# EAGLE design scanner (EAGLE 9.2.2)
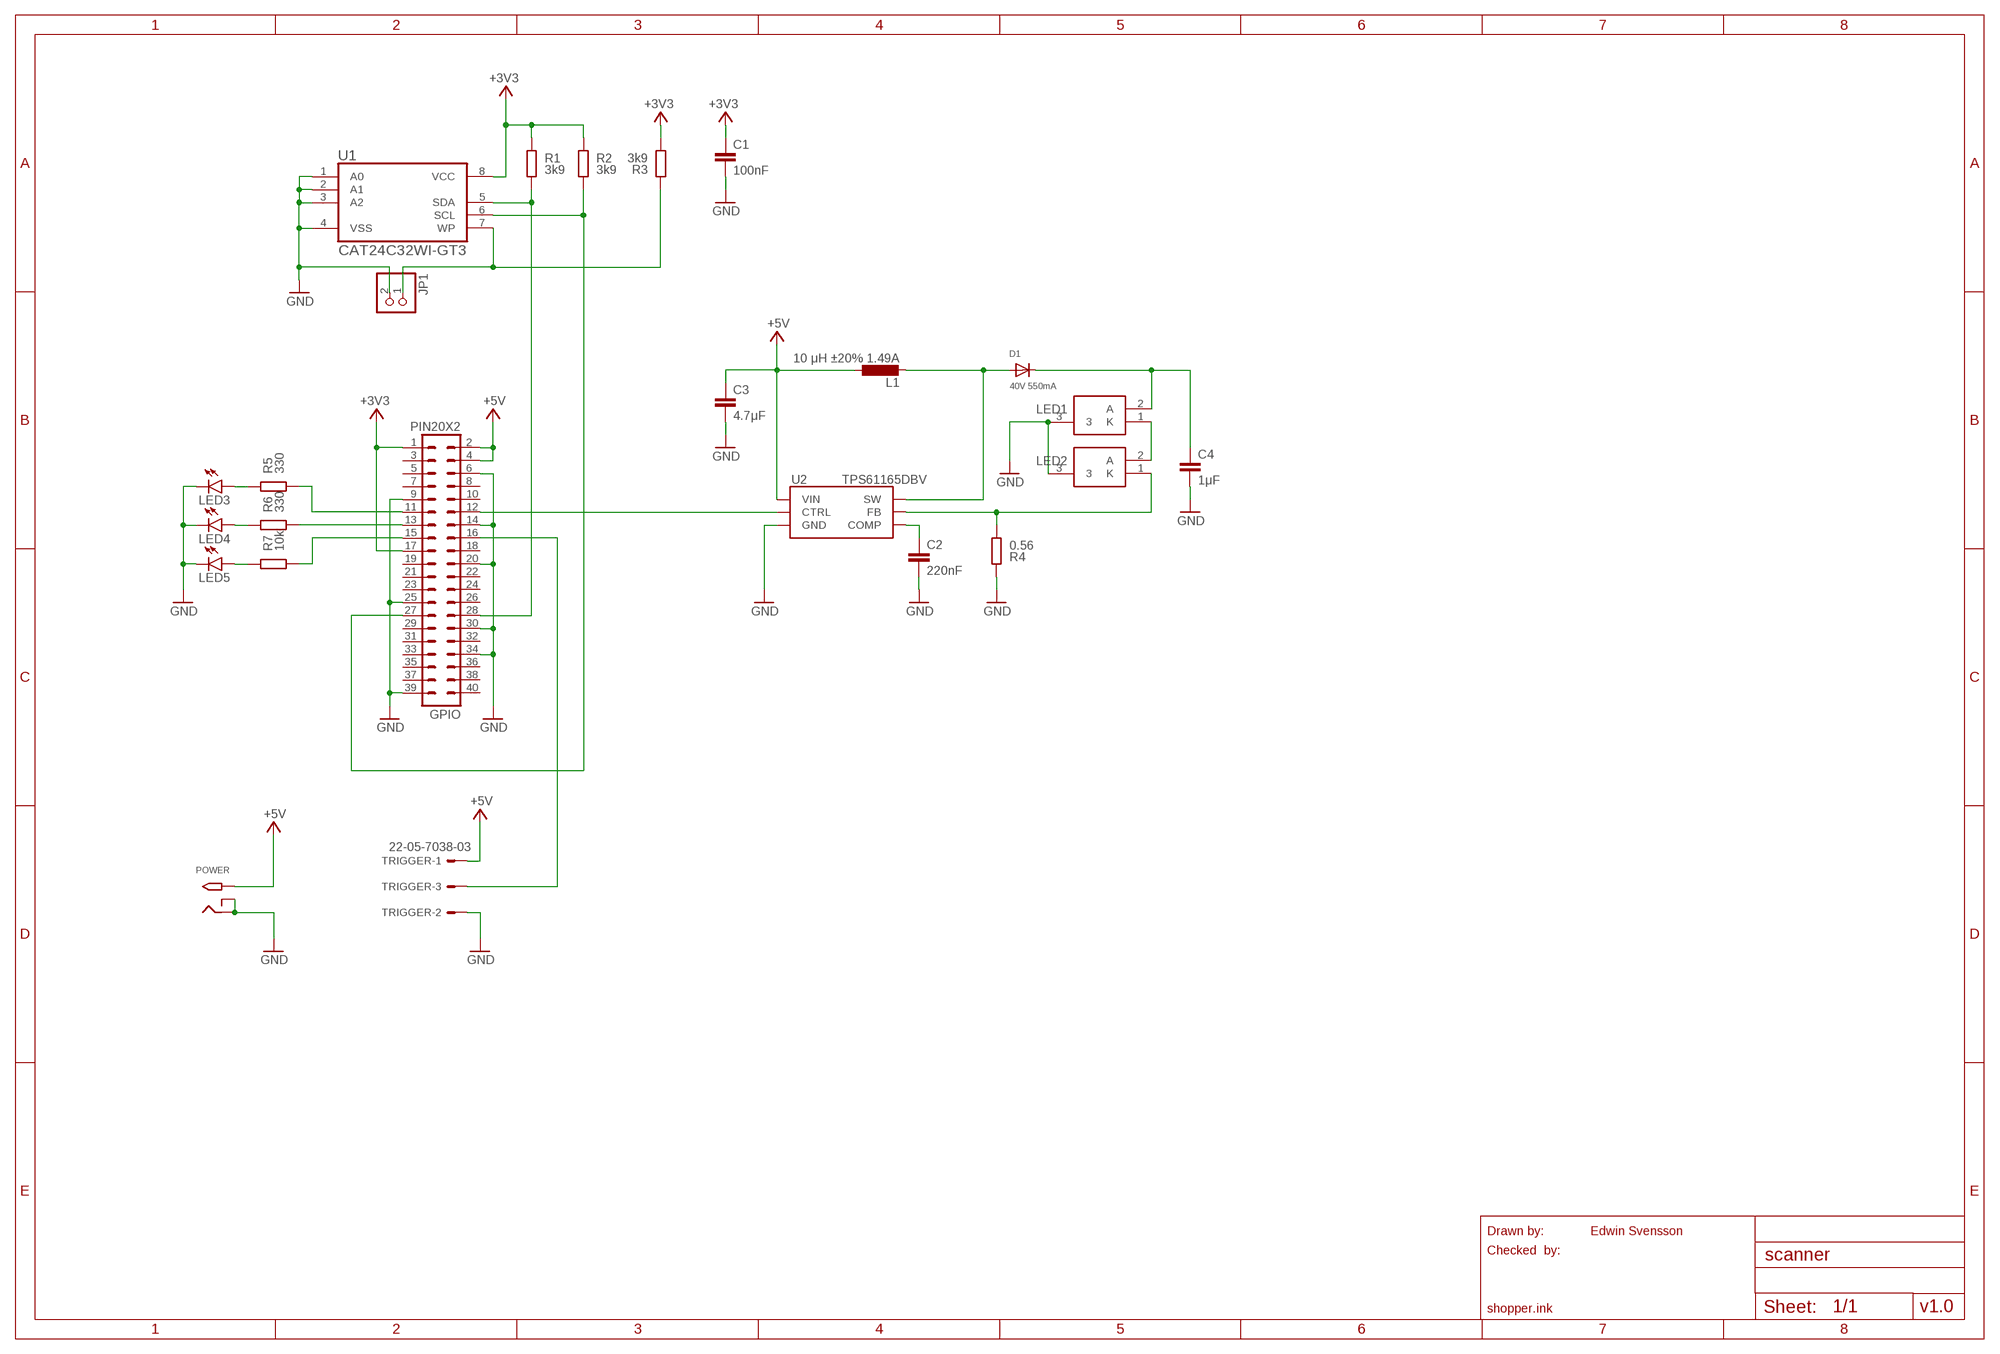
[diagram p0: schematic, sheet 1]

## Parts
C1  100nF  C-EUC0805K  [C0805K]
C2  220nF  C-EUC0805K  [C0805K]
C3  4.7μF  C-EUC0805K  [C0805K]
C4  1μF  C-EUC0805K  [C0805K]
D1  40V 550mA  DIODESOD-123  [SOD-123]
GPIO  PIN20X2  [PIN_20X2]
JP1  PINHD-1X2  [1X02]
L1  10 μH ±20% 1.49A  D53LC  [D53LC]
LED1  LW_W5SM-JYKY-JKQL-1  [LWW5SMJYKYJKQL1]
LED2  LW_W5SM-JYKY-JKQL-1  [LWW5SMJYKYJKQL1]
LED3  LEDCHIP-LED0805  [CHIP-LED0805]
LED4  LEDCHIP-LED0805  [CHIP-LED0805]
LED5  LEDCHIP-LED0805  [CHIP-LED0805]
POWER  2.1MMJACKTHM  [PJ-102A]
R1  3k9  R-EU_M0805  [M0805]
R2  3k9  R-EU_M0805  [M0805]
R3  3k9  R-EU_M0805  [M0805]
R4  0.56  R-EU_M0805  [M0805]
R5  330  R-EU_M0805  [M0805]
R6  330  R-EU_M0805  [M0805]
R7  10k  R-EU_M0805  [M0805]
TRIGGER  22-05-7038-03  [7395-03]
U1  CAT24C32WI-GT3  [SOIC127P600X175-8N]
U2  TPS61165DBV  [SOT-23-6]

## Nets
+3V3: C1.1 GPIO.1 GPIO.17 R1.2 R2.2 R3.1 U1.8(VCC)
+5V: C3.1 GPIO.2 GPIO.4 L1.1 POWER.TIP TRIGGER.1 U2.1(VIN)
EEPROM_SCL: GPIO.27 R2.1 U1.6(SCL)
EEPROM_SDA: GPIO.28 R1.1 U1.5(SDA)
EEPROM_WP: JP1.1 R3.2 U1.7(WP)
GND: C1.2 C2.2 C3.2 C4.2 GPIO.6 GPIO.9 GPIO.14 GPIO.20 GPIO.25 GPIO.30 GPIO.34 GPIO.39 JP1.2 LED1.3 LED2.3 LED3.C LED4.C LED5.C POWER.RING POWER.RING_SW R4.2 TRIGGER.2 U1.1(A0) U1.2(A1) U1.3(A2) U1.4(VSS) U2.4(GND)
LED3: GPIO.11 R5.1
LED4: GPIO.13 R6.1
LED5: GPIO.15 R7.1
LED_CTRL: GPIO.12 U2.2(CTRL)
LED_FB: LED2.1(K) R4.1 U2.6(FB)
LED_SW: D1.A L1.2 U2.3(SW)
N$7: C2.1 U2.5(COMP)
N$10: C4.1 D1.C LED1.2(A)
N$11: LED1.1(K) LED2.2(A)
N$13: LED3.A R5.2
N$17: LED4.A R6.2
N$18: LED5.A R7.2
TRIGGER: GPIO.16 TRIGGER.3
Unconnected: GPIO.3 GPIO.5 GPIO.7 GPIO.8 GPIO.10 GPIO.18 GPIO.19 GPIO.21 GPIO.22 GPIO.23 GPIO.24 GPIO.26 GPIO.29 GPIO.31 GPIO.32 GPIO.33 GPIO.35 GPIO.36 GPIO.37 GPIO.38 GPIO.40

## Notes on the sheet
- Drawn by: | Edwin Svensson
- Checked  by:
- shopper.ink | v1.0

## Library data of the parts
C1-C4 = resistor:C-EU: CAPACITOR, European symbol; DIELECTRIC: X7R
D1 = adafruit:DIODE: Diode SMADIODE - SMA Surface Mount Package 20V 1A Schottky Diode Digikey: 641-1014-6-ND DO-1N4148 - Through Hole Small Current Diode SOD-123 20V 1 A (.5mV Vf) Schottky Diode - Digikey: MBRX120TPMSCT-ND SOD-323 10V 570mA (.38mV Vf, 3ns) Schottky Diode - Digikey: ZLLS410CT-ND SOD-523 30V 30mA Schottky Diode (RB751S-40TE61) - Digikey: RB751S-40TE61CT-ND SOT23-R/W - SOT23 Package (R = Solder Paste/Reflow Ovens, W = Hand-Soldering) BAT54Film 40V 300mA - Digikey: 497-7162-1-ND
GPIO = FLYFISH:PIN20X2
JP1 = pinhead:PINHD-1X2: PIN HEADER
L1 = m-pad-2.1:D53LC: TOKO's D53LC Fixed Inductors for Surface Mounting TYPE D53LC Inductance Range:1.1 - 220mH Frequency Range: 0.1 - 1MHz Features Low profile (3.0mm max.) Magnetically shielded Available on tape and reel for auto-insertion Suitable for reflow soldering Part Number A915AY-xxxM Please send any comments to: messi@users.sourceforge.net
LED1 LED2 = LW_W5SM-JYKY-JKQL-1:LW_W5SM-JYKY-JKQL-1: High Power LEDs - White White, 5600K Source: Datasheet <https://www.osram.com/os/ecat/Golden DRAGON LW W5SM/com/en/class_pim_web_catalog_103489/global/prd_pim_device_2190693/>; DESCRIPTION: High Power LEDs - White White, 5600K; HEIGHT: 1mm; MANUFACTURER_NAME: OSRAM Opto Semiconductors; MANUFACTURER_PART_NUMBER: LW W5SM-JYKY-JKQL-1; MOUSER_PART_NUMBER: 720-LWW5SMJYKYJKQL1; MOUSER_PRICE-STOCK: https://www.mouser.com/Search/Refine.aspx?Keyword=720-LWW5SMJYKYJKQL1
LED3-LED5 = led:LED: LED OSRAM: - CHIPLED LG R971, LG N971, LY N971, LG Q971, LY Q971, LO R971, LY R971 LH N974, LH R974 LS Q976, LO Q976, LY Q976 LO Q996 - Hyper CHIPLED LW Q18S LB Q993, LB Q99A, LB R99A - SideLED LS A670, LO A670, LY A670, LG A670, LP A670 LB A673, LV A673, LT A673, LW A673 LH A674 LY A675 LS A676, LA A676, LO A676, LY A676, LW A676 LS A679, LY A679, LG A679 - Hyper Micro SIDELED® LS Y876, LA Y876, LO Y876, LY Y876 LT Y87S - SmartLED LW L88C, LW L88S LB L89C, LB L89S, LG L890 LS L89K, LO L89K, LY L89K LS L896, LA L896, LO L896, LY L896 - TOPLED LS T670, LO T670, LY T670, LG T670, LP T670 LSG T670, LSP T670, LSY T670, LOP T670, LYG T670 LG T671, LOG T671, LSG T671 LB T673, LV T673, LT T673, LW T673 LH T674 LS T676, LA T676, LO T676, LY T676, LB T676, LH T676, LSB T676, LW T676 LB T67C, LV T67C, LT T67C, LS T67K, LO T67K, LY T67K, LW E67C LS E67B, LA E67B, LO E67B, LY E67B, LB E67C, LV E67C, LT E67C LW T67C LS T679, LY T679, LG T679 LS T770, LO T770, LY T770, LG T770, LP T770 LB T773, LV T773, LT T773, LW T773 LH T774 LS E675, LA E675, LY E675, LS T675 LS T776, LA T776, LO T776, LY T776, LB T776 LHGB T686 LT T68C, LB T68C - Hyper Mini TOPLED® LB M676 - Mini TOPLED Santana® LG M470 LS M47K, LO M47K, LY M47K Source: http://www.osram.convergy.de LUXEON: - LUMILED® LXK2-PW12-R00, LXK2-PW12-S00, LXK2-PW14-U00, LXK2-PW14-V00 LXK2-PM12-R00, LXK2-PM12-S00, LXK2-PM14-U00 LXK2-PE12-Q00, LXK2-PE12-R00, LXK2-PE12-S00, LXK2-PE14-T00, LXK2-PE14-U00 LXK2-PB12-K00, LXK2-PB12-L00, LXK2-PB12-M00, LXK2-PB14-N00, LXK2-PB14-P00, LXK2-PB14-Q00 LXK2-PR12-L00, LXK2-PR12-M00, LXK2-PR14-Q00, LXK2-PR14-R00 LXK2-PD12-Q00, LXK2-PD12-R00, LXK2-PD12-S00 LXK2-PH12-R00, LXK2-PH12-S00 LXK2-PL12-P00, LXK2-PL12-Q00, LXK2-PL12-R00 Source: www.luxeon.com KINGBRIGHT: KA-3528ASYC Source: www.kingbright.com
POWER = adafruit:2.1MMJACK: 2.1mm x 5.5mm THM DC jack with internal switch. Digikey part #PJ-102A, 4UCON part #05537 2.1mm x 5.5mm SMT DC jack with internal switch. Digikey part #PJ-002A-SMT, 4UCON part #03267 By microbuilder.eu & adafruit.com
R1-R7 = resistor:R-EU_: RESISTOR, European symbol; TOLERANCE: 5%
TRIGGER = con-molex:22-?-03: CONNECTOR wire to board 2.54 mm (.1 inch) pitch header; MF: MOLEX; OC_FARNELL: unknown; OC_NEWARK: unknown
U1 = mbed-HDK-IC:CAT24C32WI-GT3: EEPROM I2C 32-Kb I2C CMOS; MPN: CAT24C32WI-GT3; OC_FARNELL: 1718129; OC_NEWARK: 08R5414; PACKAGE: SOIC-8; SUPPLIER: CATALYST SEMICONDUCTOR
U2 = dword1511-pmic-dcdc:TPS61165: Boost LED driver

## Board
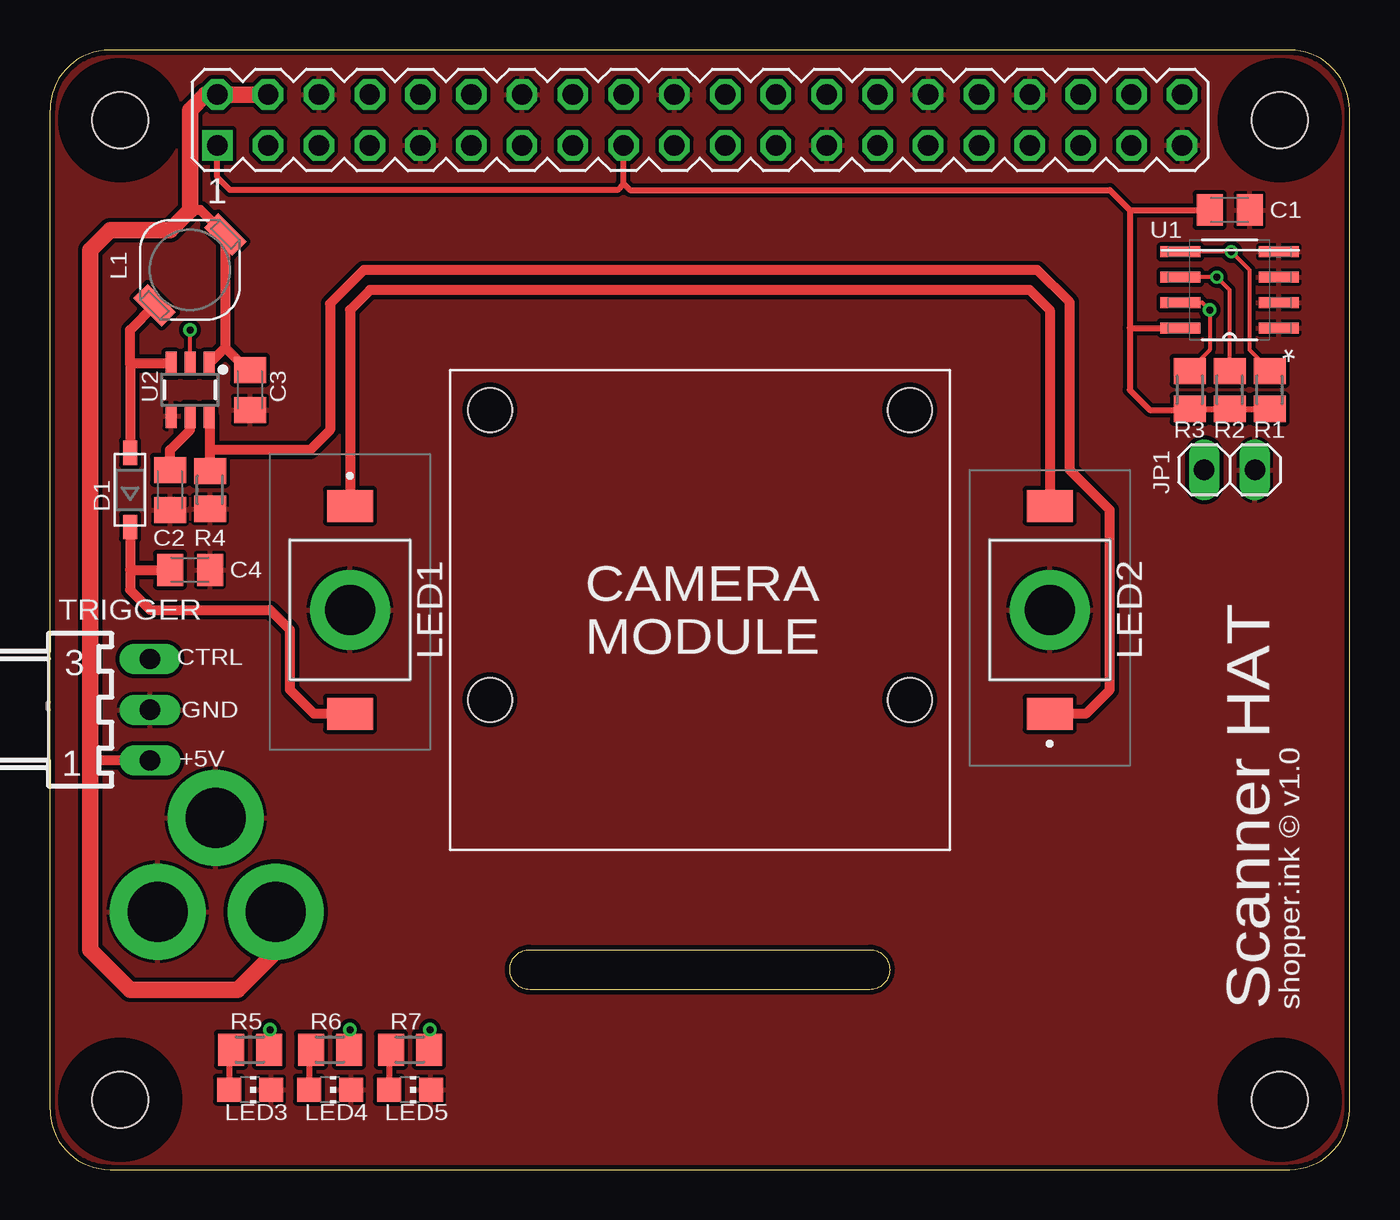
[diagram p1: board, top side]
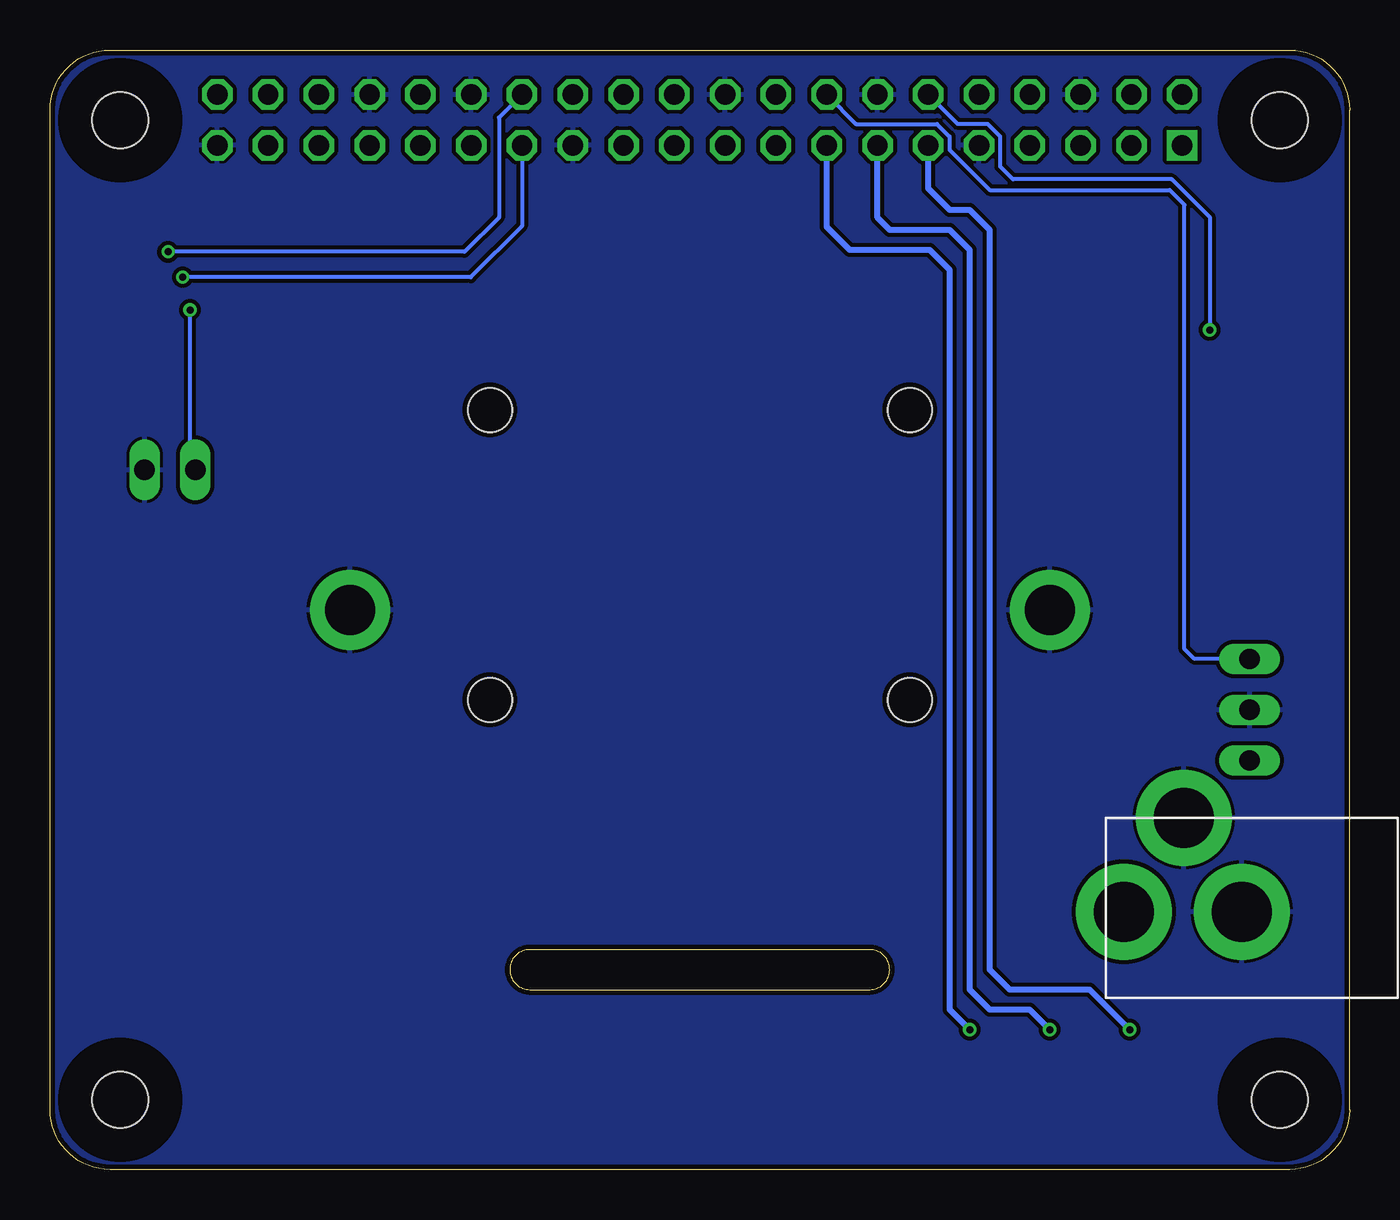
[diagram p2: board, bottom side, seen from below]

Size 65 x 56 mm. Coordinates in mm from the lower left corner, seen from the top.
Outline: 0,3 arc90 3,0 62,0 arc90 65,3 65,53 arc90 62,56 3,56 arc90 0,53 0,3
Outline: 23,10 arc-90 24,11 41,11 arc-90 42,10 arc-90 41,9 24,9 arc-90 23,10
Copper layers (1*16): Top 0.035mm / dielectric 1.5mm / Bottom 0.035mm
Design rules "ITEADstudio_DRC *": minimum track width 6mil, minimum drill 12mil, track to track 8mil, track to pad 8mil, pad to pad 8mil, via to via 8mil, smd to smd 0mil, copper to edge 10mil, drill to drill 10mil, minimum pad ring 10mil, minimum via ring 6mil, stop-mask expansion 2mil, vias tented up to drill 100mil, thermal gap 6mil
Holes 2.8 mm at 3.5,3.5 3.5,52.5 61.5,52.5 61.5,3.5
Holes 2.2 mm at 22,38 22,23.5 43,38 43,23.5
tRestrict: area 1.9,51 to 5,54; area 60,51 to 63,54; area 60,1.9 to 63,5; area 1.9,1.9 to 5,5
bRestrict: area 1.9,1.9 to 5,5; area 60,1.9 to 63,5; area 60,51 to 63,54; area 1.9,51 to 5,54
Milling: 6 lines

### Footprints (pad centres in the part's own frame; a part is rotated, then mirrored left to right if it is on the bottom)
C0805K = smd 1.3 x 1.6: 1 -1,0; 2 1,0
SOD-123 = smd 1.2 x 0.7: A 1.85,0; C -1.85,0
PIN_20X2 = drill 1.016 square: 1 -24.13,-1.27 | drill 1.016 octagon: 2 -24.13,1.27; 3 -21.59,-1.27; 4 -21.59,1.27; 5 -19.05,-1.27; 6 -19.05,1.27; 7 -16.51,-1.27; 8 -16.51,1.27; 9 -13.97,-1.27; 10 -13.97,1.27; 11 -11.43,-1.27; 12 -11.43,1.27; 13 -8.89,-1.27; 14 -8.89,1.27; 15 -6.35,-1.27; 16 -6.35,1.27; 17 -3.81,-1.27; 18 -3.81,1.27; 19 -1.27,-1.27; 20 -1.27,1.27; 21 1.27,-1.27; 22 1.27,1.27; 23 3.81,-1.27; 24 3.81,1.27; 25 6.35,-1.27; 26 6.35,1.27; 27 8.89,-1.27; 28 8.89,1.27; 29 11.43,-1.27; 30 11.43,1.27; 31 13.97,-1.27; 32 13.97,1.27; 33 16.51,-1.27; 34 16.51,1.27; 35 19.05,-1.27; 36 19.05,1.27; 37 21.59,-1.27; 38 21.59,1.27; 39 24.13,-1.27; 40 24.13,1.27
1X02 = drill 1.016 long: 1 -1.27,0; 2 1.27,0
D53LC = smd 1 x 2: 1 -2.5,0; 2 2.5,0
LWW5SMJYKYJKQL1 = smd 1.6 x 2.3: 1 -5.2,0; 2 5.2,0 | drill 2.5 pad 4: 3 0,0
CHIP-LED0805 = smd 1.2 x 1.2: A 0,-1.05; C 0,1.05
PJ-102A = drill 3 pad 4.8: RING 0.1,-3.39; RING_SW -4.6,-6.29; TIP 0.1,-9.29
M0805 = smd 1.3 x 1.6: 1 -0.95,0; 2 0.95,0
7395-03 = drill 1.016 long: 1 2.54,0; 2 0,0; 3 -2.54,0
SOIC127P600X175-8N = smd 1.981 x 0.559: 1 -2.464,1.905; 2 -2.464,0.635; 3 -2.464,-0.635; 4 -2.464,-1.905; 5 2.464,-1.905; 6 2.464,-0.635; 7 2.464,0.635; 8 2.464,1.905
SOT-23-6 = smd 0.55 x 1.2: 1 -0.95,-1.3; 2 0,-1.3; 3 0.95,-1.3; 4 0.95,1.3; 5 0,1.3; 6 -0.95,1.3

### Placement (x,y rotation side)
C1  59,48 0 top
C2  6,34 270 top
C3  10,39 270 top
C4  7,30 0 top
D1  4,34 90 top
GPIO  32.5,52.5 0 top
JP1  59,35 0 top
L1  7,45 225 top
LED1  15,28 270 top
LED2  50,28 90 top
LED3  RED  [CHIP-LED0805]  10,4 270 top
LED4  GREEN  [CHIP-LED0805]  14,4 270 top
LED5  BLUE  [CHIP-LED0805]  18,4 270 top
POWER  2,13 270 bottom
R1  61,39 270 top
R2  59,39 270 top
R3  57,39 90 top
R4  8,34 270 top
R5  10,6 180 top
R6  14,6 180 top
R7  18,6 180 top
TRIGGER  5,23 270 top
U1  59,44 180 top
U2  7,39 180 top

### Tracks (layer width: path | path; a pad name or v marks a point on that pad's centre or on a via)
+3V3
  Top 0.305: 28.69,49.31 28.38,49 9,49 8.37,49.63 GPIO.1 | 28.69,49.31 GPIO.17 | 28.69,49.31 29,49 53,49 54,48 | 54,48 54,42.09 | 54,42.09 U1.8 | 54,48 C1.1 | 54,42.09 54,39 55,38 56.95,38 R3.1 R2.2 R1.2
+5V
  Top 0.508: 8.77,41.12 L1.1 7.54,48 7,48 | 8.77,41.12 U2.1 | 8.77,41.12 9.89,40 C3.1 | TRIGGER.1 2.14,20.46 2,20.32
  Top 0.813: GPIO.4 GPIO.2 7.77,53.77 7,53 7,48 6,47 3,47 2,46 2,20.32 2,11 4,9 9.39,9 11.29,10.9 POWER.TIP
EEPROM_SCL  (via drill 0.35)
  Top 0.203: U1.6 v58.37,44.63 59,44 R2.1
  Bottom 0.203: GPIO.27 41.39,47.2 43.95,44.63 v58.37,44.63
EEPROM_SDA  (via drill 0.35)
  Top 0.203: R1.1 61,40 60,41 60,45 v59.09,45.91 U1.5
  Bottom 0.203: GPIO.28 42.55,52.62 42.55,47.62 44.27,45.91 v59.09,45.91
EEPROM_WP  (via drill 0.35)
  Top 0.203: R3.2 57,40 58,41 v58,43 57.63,43.37 U1.7
  Bottom 0.203: JP1.1 58,35.27 v58,43
GND
  pour Bottom: -1,57 -1,-1 66,-1 66,57
  pour Top: -1,57 -1,-1 66,-1 66,57
LED3  (via drill 0.35)
  Top 0.305: R5.1 10.95,6.95 v11,7
  Bottom 0.305: v11,7 13,9 17,9 18,10 18,47 19,48 20,48 21.07,49.07 GPIO.11
LED4  (via drill 0.35)
  Top 0.305: R6.1 14.95,6.95 v15,7
  Bottom 0.305: v15,7 16,8 18,8 19,9 19,46 20,47 23,47 23.61,47.61 GPIO.13
LED5  (via drill 0.35)
  Top 0.305: R7.1 18.95,6.95 v19,7
  Bottom 0.305: v19,7 20,8 20,45 21,46 25,46 26.15,47.15 GPIO.15
LED_CTRL  (via drill 0.35)
  Top 0.203: U2.2 v7,42
  Bottom 0.203: v7,42 7,47.64 8.89,49.53 16.83,49.53 17.46,50.16 17.46,51.67 18.09,52.3 19.6,52.3 GPIO.12
LED_FB
  Top 0.508: LED2.1 51.8,22.8 53,24 53,33 51,35 51,43.38 49.38,45 15.69,45 14,43.31 14,37 13,36 8,36 | R4.1 8,36 | 8,36 8,37.65 U2.6
LED_SW
  Top 0.508: U2.3 4,40.3 | 4,40.3 D1.A | 4,40.3 4,42 L1.2
N$7
  Top 0.508: C2.1 6,36 7,37 U2.5
N$10
  Top 0.508: D1.C 4,30 | 4,30 4,29 5,28 11,28 12,27 12,24 13.2,22.8 LED1.2 | 4,30 C4.1
N$11
  Top 0.508: LED2.2 50,43 49,44 16,44 15,43 LED1.1
N$13
  Top 0.305: R5.2 8.95,5.9 LED3.A
N$17
  Top 0.305: R6.2 12.95,5.9 LED4.A
N$18
  Top 0.305: R7.2 16.95,5.9 LED5.A
TRIGGER
  Bottom 0.203: TRIGGER.3 7.76,25.54 8.26,26.04 8.26,48.26 8.99,49 18,49 20,51 20,51.67 20.63,52.3 24.68,52.3 GPIO.16

### Text on the board
tNames: CAMERA / MODULE | CTRL | GND | +5V | Scanner HAT | shopper.ink © v1.0